# Altium schematic sheet PMOD_IO.SchDoc
size B; Organization: Altium Limited; Address1: 3 Minna Close; Address2: Belrose; Address3: NSW 2085; Address4: Australia; SheetNumber: 6; SheetTotal: 7
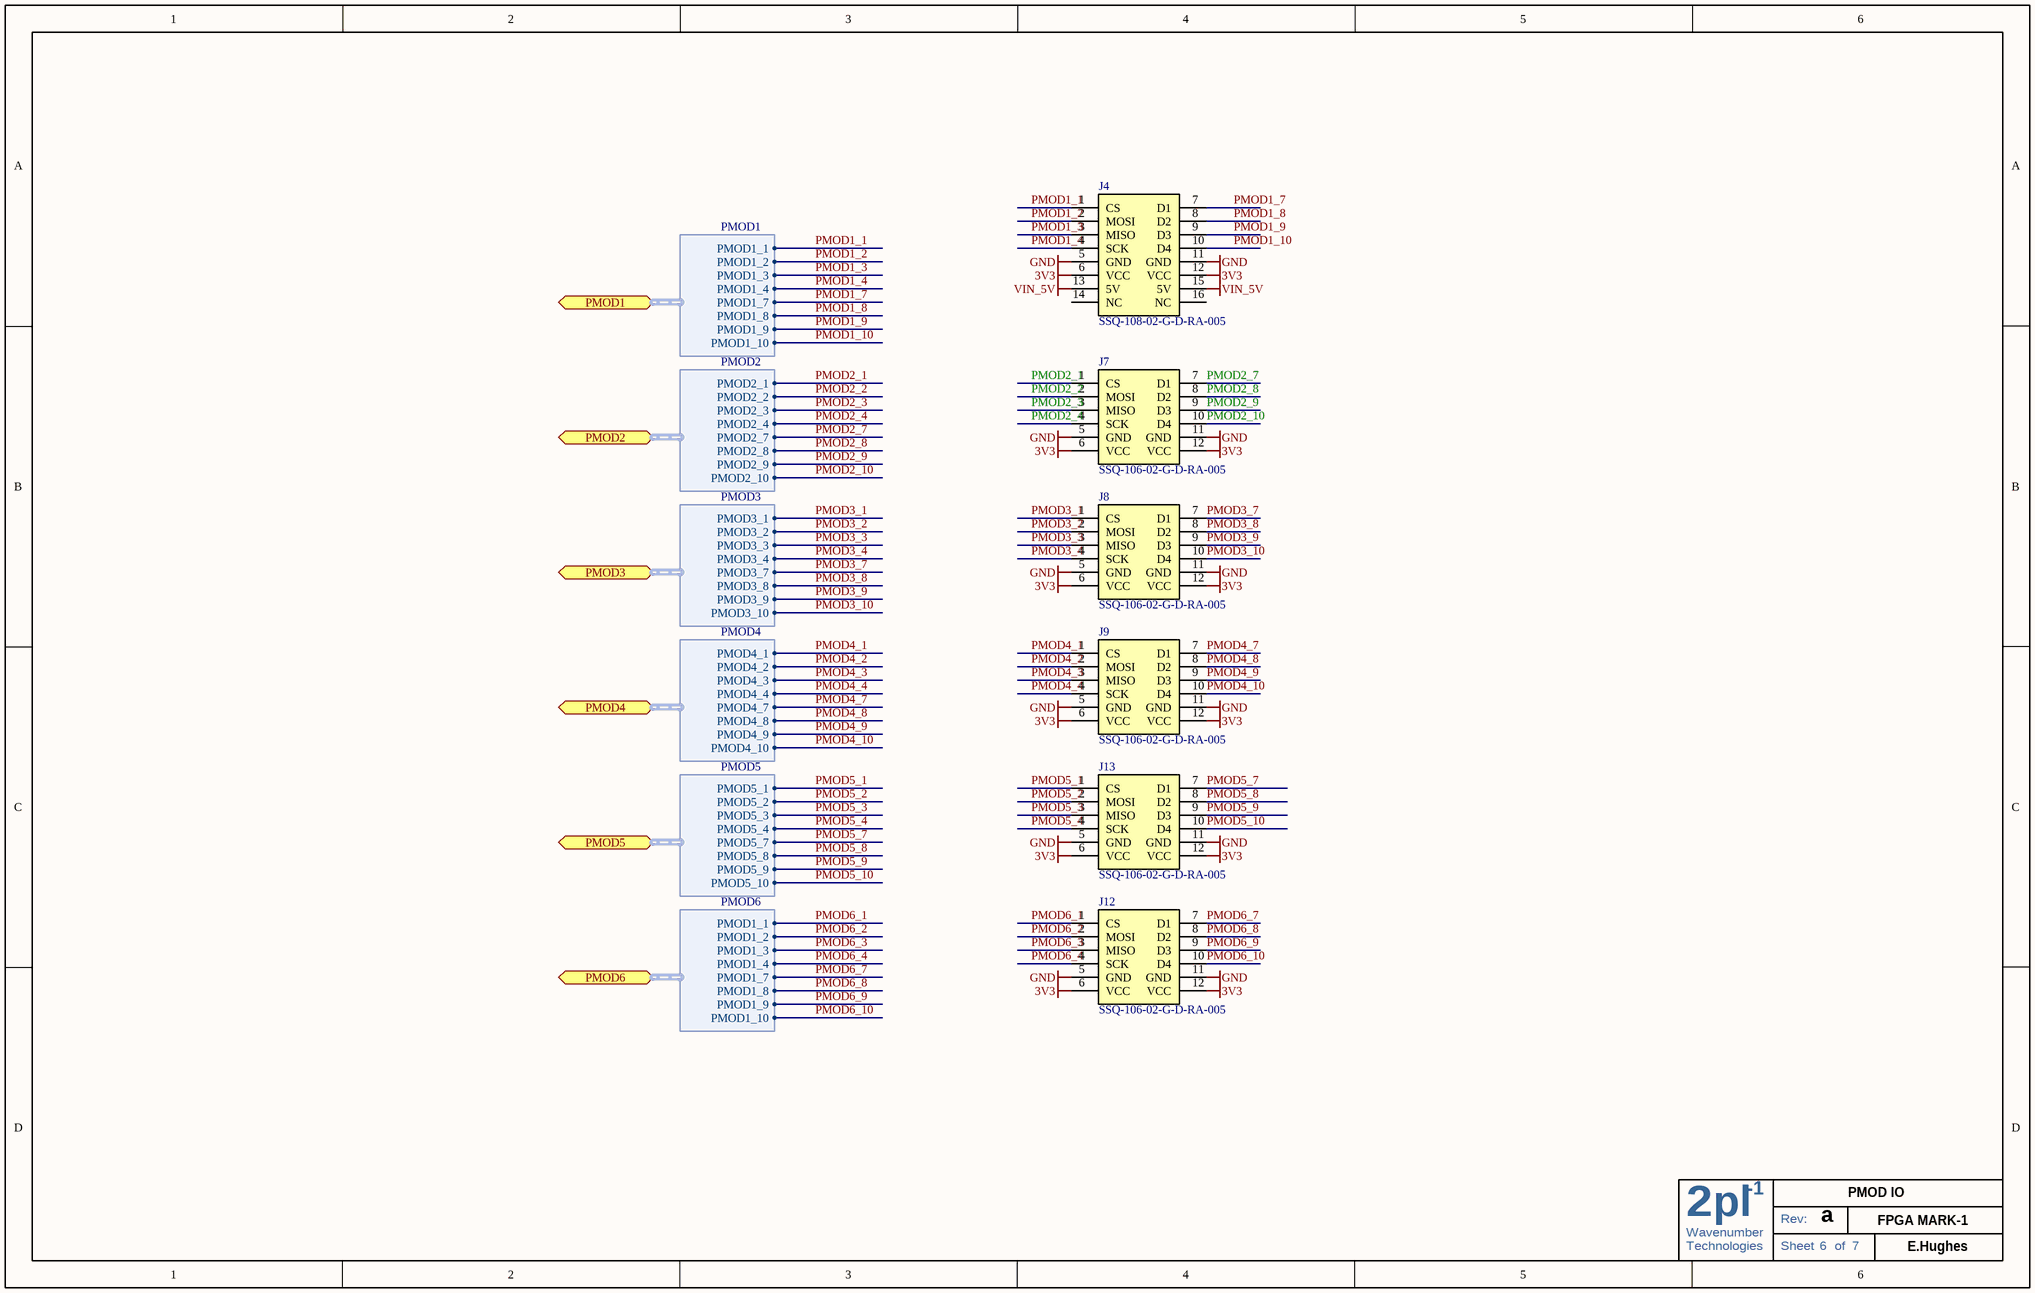
[diagram p0: PMOD_IO.SchDoc]

## Parts
J4  SSQ-108-02-G-D-RA-005  [PMOD HEADER8 - SSQ-108-02-G-D-RA]
J7  SSQ-106-02-G-D-RA-005  [PMOD HEADER - SSQ-106-02-G-D-RA]
J8  SSQ-106-02-G-D-RA-005  [PMOD HEADER - SSQ-106-02-G-D-RA]
J9  SSQ-106-02-G-D-RA-005  [PMOD HEADER - SSQ-106-02-G-D-RA]
J12  SSQ-106-02-G-D-RA-005  [PMOD HEADER - SSQ-106-02-G-D-RA]
J13  SSQ-106-02-G-D-RA-005  [PMOD HEADER - SSQ-106-02-G-D-RA]

## Ports
PMOD1 (harness PMOD1), PMOD2 (harness PMOD2), PMOD3 (harness PMOD3), PMOD4 (harness PMOD4), PMOD5 (harness PMOD5), PMOD6 (harness PMOD6)

## Harnesses
PMOD1: PMOD1_1, PMOD1_2, PMOD1_3, PMOD1_4, PMOD1_7, PMOD1_8, PMOD1_9, PMOD1_10
PMOD2: PMOD2_1, PMOD2_2, PMOD2_3, PMOD2_4, PMOD2_7, PMOD2_8, PMOD2_9, PMOD2_10
PMOD3: PMOD3_1, PMOD3_2, PMOD3_3, PMOD3_4, PMOD3_7, PMOD3_8, PMOD3_9, PMOD3_10
PMOD4: PMOD4_1, PMOD4_2, PMOD4_3, PMOD4_4, PMOD4_7, PMOD4_8, PMOD4_9, PMOD4_10
PMOD5: PMOD5_1, PMOD5_2, PMOD5_3, PMOD5_4, PMOD5_7, PMOD5_8, PMOD5_9, PMOD5_10
PMOD6: PMOD1_1, PMOD1_2, PMOD1_3, PMOD1_4, PMOD1_7, PMOD1_8, PMOD1_9, PMOD1_10

## Nets
3V3: J4.6(VCC) J4.12(VCC) J7.6(VCC) J7.12(VCC) J8.6(VCC) J8.12(VCC) J9.6(VCC) J9.12(VCC) J12.6(VCC) J12.12(VCC) J13.6(VCC) J13.12(VCC)
GND: J4.5(GND) J4.11(GND) J7.5(GND) J7.11(GND) J8.5(GND) J8.11(GND) J9.5(GND) J9.11(GND) J12.5(GND) J12.11(GND) J13.5(GND) J13.11(GND)
VIN_5V: J4.13(5V) J4.15(5V)
PMOD1_1: J4.1(CS) ; port PMOD1.PMOD1_1
PMOD1_2: J4.2(MOSI) ; port PMOD1.PMOD1_2
PMOD1_3: J4.3(MISO) ; port PMOD1.PMOD1_3
PMOD1_4: J4.4(SCK) ; port PMOD1.PMOD1_4
PMOD1_7: J4.7(D1) ; port PMOD1.PMOD1_7
PMOD1_8: J4.8(D2) ; port PMOD1.PMOD1_8
PMOD1_9: J4.9(D3) ; port PMOD1.PMOD1_9
PMOD1_10: J4.10(D4) ; port PMOD1.PMOD1_10
PMOD2_1: J7.1(CS) ; port PMOD2.PMOD2_1
PMOD2_2: J7.2(MOSI) ; port PMOD2.PMOD2_2
PMOD2_3: J7.3(MISO) ; port PMOD2.PMOD2_3
PMOD2_4: J7.4(SCK) ; port PMOD2.PMOD2_4
PMOD2_7: J7.7(D1) ; port PMOD2.PMOD2_7
PMOD2_8: J7.8(D2) ; port PMOD2.PMOD2_8
PMOD2_9: J7.9(D3) ; port PMOD2.PMOD2_9
PMOD2_10: J7.10(D4) ; port PMOD2.PMOD2_10
PMOD3_1: J8.1(CS) ; port PMOD3.PMOD3_1
PMOD3_2: J8.2(MOSI) ; port PMOD3.PMOD3_2
PMOD3_3: J8.3(MISO) ; port PMOD3.PMOD3_3
PMOD3_4: J8.4(SCK) ; port PMOD3.PMOD3_4
PMOD3_7: J8.7(D1) ; port PMOD3.PMOD3_7
PMOD3_8: J8.8(D2) ; port PMOD3.PMOD3_8
PMOD3_9: J8.9(D3) ; port PMOD3.PMOD3_9
PMOD3_10: J8.10(D4) ; port PMOD3.PMOD3_10
PMOD4_1: J9.1(CS) ; port PMOD4.PMOD4_1
PMOD4_2: J9.2(MOSI) ; port PMOD4.PMOD4_2
PMOD4_3: J9.3(MISO) ; port PMOD4.PMOD4_3
PMOD4_4: J9.4(SCK) ; port PMOD4.PMOD4_4
PMOD4_7: J9.7(D1) ; port PMOD4.PMOD4_7
PMOD4_8: J9.8(D2) ; port PMOD4.PMOD4_8
PMOD4_9: J9.9(D3) ; port PMOD4.PMOD4_9
PMOD4_10: J9.10(D4) ; port PMOD4.PMOD4_10
PMOD5_1: J13.1(CS) ; port PMOD5.PMOD5_1
PMOD5_2: J13.2(MOSI) ; port PMOD5.PMOD5_2
PMOD5_3: J13.3(MISO) ; port PMOD5.PMOD5_3
PMOD5_4: J13.4(SCK) ; port PMOD5.PMOD5_4
PMOD5_7: J13.7(D1) ; port PMOD5.PMOD5_7
PMOD5_8: J13.8(D2) ; port PMOD5.PMOD5_8
PMOD5_9: J13.9(D3) ; port PMOD5.PMOD5_9
PMOD5_10: J13.10(D4) ; port PMOD5.PMOD5_10
PMOD6_1: J12.1(CS) ; port PMOD6.PMOD1_1
PMOD6_2: J12.2(MOSI) ; port PMOD6.PMOD1_2
PMOD6_3: J12.3(MISO) ; port PMOD6.PMOD1_3
PMOD6_4: J12.4(SCK) ; port PMOD6.PMOD1_4
PMOD6_7: J12.7(D1) ; port PMOD6.PMOD1_7
PMOD6_8: J12.8(D2) ; port PMOD6.PMOD1_8
PMOD6_9: J12.9(D3) ; port PMOD6.PMOD1_9
PMOD6_10: J12.10(D4) ; port PMOD6.PMOD1_10

Not connected (* = marked no-connect by the designer): J4 14(NC) 16(NC)

## Notes on the sheet
- a
- PMOD IO
- FPGA MARK-1
- E.Hughes
- 2
- Wavenumber
- pl
- -1
- Rev:
- Technologies
- Sheet
- of

## Library data of the parts
J4 = P-MOD - SSQ-108-02-G-D-RA-005: SAMTEC - SSQ-108-02-G-D-RA-005 - 2MM SOCKET STRIPS; Supplier 1: Newark; Supplier Part Number 1: 81P8253; Manufacturer: SAMTEC; Manufacturer Part Number: SSQ-108-02-G-D-RA-005; Stock 1: 0; Pricing 1: 1=1.58, 20834=1.4, 41667=1.32 (USD); Value: SSQ-108-02-G-D-RA-005
J7-J9 J12 J13 = P-MOD - SSQ-106-02-G-D-RA-005: SAMTEC - SSQ-106-02-G-D-RA-005 - 2MM SOCKET STRIPS; Supplier 1: Newark; Supplier Part Number 1: 81P8253; Manufacturer: SAMTEC; Manufacturer Part Number: SSQ-106-02-G-D-RA-005; Stock 1: 0; Pricing 1: 1=1.58, 20834=1.4, 41667=1.32 (USD); Value: SSQ-106-02-G-D-RA-005